# EAGLE design SwitchlesMD_OSC_small_reset_SMD_6 (EAGLE 9.0.0)
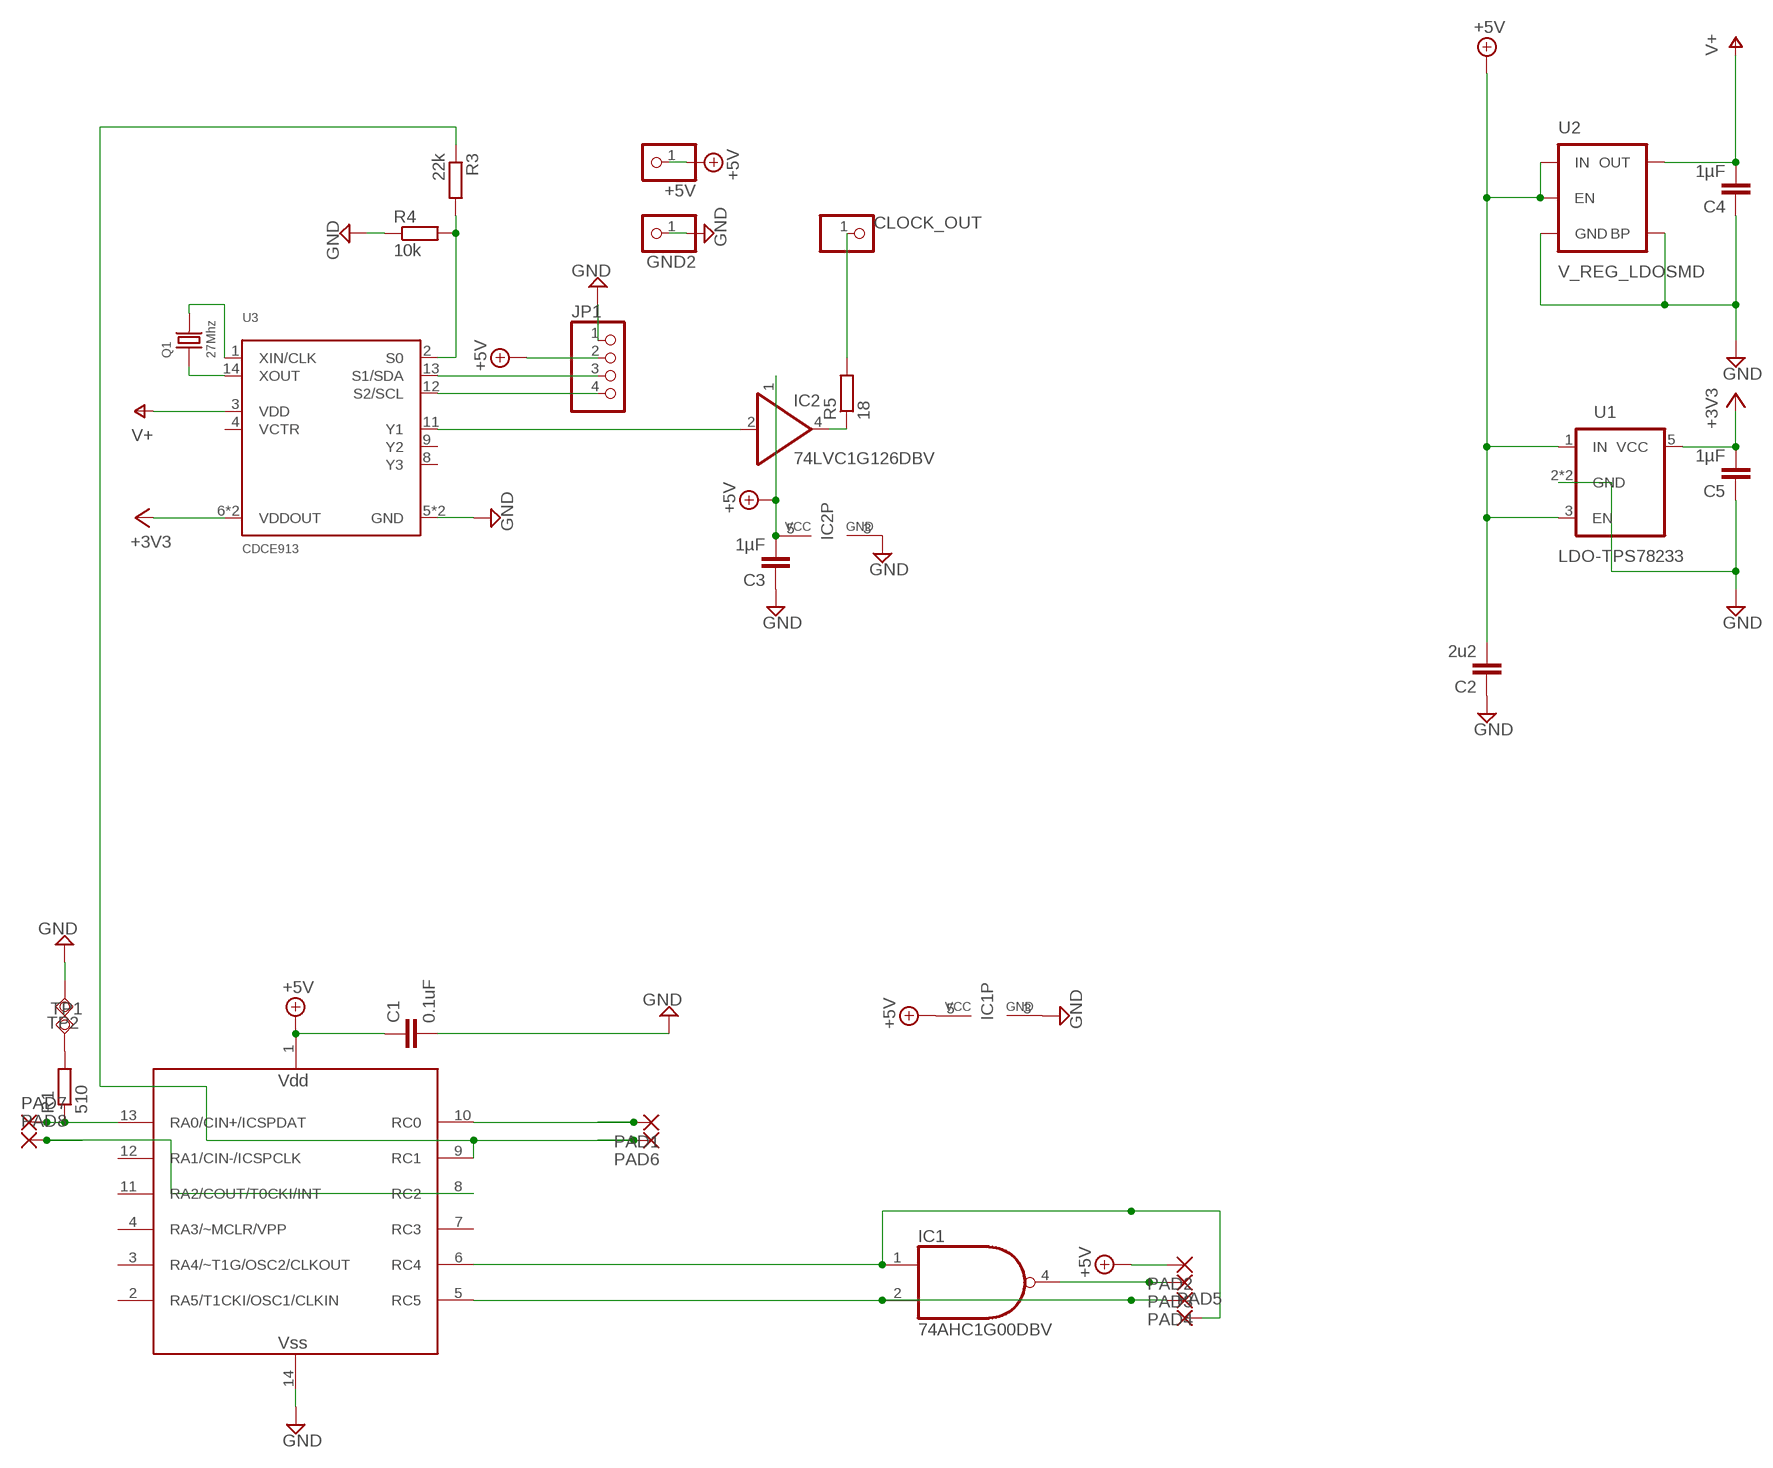
[diagram p0: schematic, sheet 1]

## Parts
+5V  PINHD-1X01_2.54  [1X01]
C1  0.1uF  C-EUC0603  [C0603]
C2  2u2  C-EUC0603  [C0603]
C3  1µF  C-EUC0603  [C0603]
C4  1µF  C-EUC0603  [C0603]
C5  1µF  C-EUC0603  [C0603]
CLOCK_OUT  PINHD-1X01_2.54  [1X01]
GND2  PINHD-1X01_2.54  [1X01]
IC1  74AHC1G00DBV  [SOT23-5]
IC2  74LVC1G126DBV  [SOT23-5]
JP1  PINHD-1X04_2.00  [1X04M]
PAD1  SMD2TOP  [SMD_SOIC]
PAD2  SMD2TOP  [SMD_SOIC]
PAD3  SMD2TOP  [SMD_SOIC]
PAD4  SMD2TOP  [SMD_SOIC]
PAD5  SMD2TOP  [SMD_SOIC]
PAD6  SMD2TOP  [SMD_SOIC]
PAD7  SMD2TOP  [SMD_SOIC]
PAD8  SMD2TOP  [SMD_SOIC]
PIC16F630  PIC16F630SL  [SOIC-14]
Q1  27Mhz  CRYSTAL'5032'  [X2-SMD-5.0X3.2X1.3MM]
R1  510  R-EU_R0603  [R0603]
R3  22k  R-EU_R0603  [R0603]
R4  10k  R-EU_R0603  [R0603]
R5  18  R-EU_R0603  [R0603]
TP1  TPSQTP07SQ  [TP07SQ]
TP2  TPSQTP07SQ  [TP07SQ]
U1  LDO-TPS78233  [SOT23-5]
U2  V_REG_LDOSMD  [SOT23-5]
U3  CDCE913  [TSSOP14]

## Nets
+1V8: C4.2 U2.5(OUT) U3.3(VDD) ; supply symbol labelled V+
+3V3: C5.2 U1.5(VCC) U3.6(VDDOUT) U3.7(VDDOUT)
+5V: +5V.1 C1.1 C2.2 C3.2 IC1.5(VCC) IC2.1(OE) IC2.5(VCC) JP1.2 PAD2.1(P) PIC16F630.1(VDD) U1.1(IN) U1.3(EN) U2.1(IN) U2.3(EN)
GND: C1.2 C2.1 C3.1 C4.1 C5.1 GND2.1 IC1.3(GND) IC2.3(GND) JP1.1 PIC16F630.14(VSS) R4.1 TP2.TP U1.2(GND) U1.4(GND) U2.2(GND) U2.4(BP) U3.5(GND) U3.10(GND)
LANG: PAD1.1(P) PIC16F630.10(RC0)
LED_EU: IC1.2(I1) PAD4.1(P) PIC16F630.5(RC5)
LED_JP: IC1.1(I0) PAD5.1(P) PIC16F630.6(RC4)
LED_US: IC1.4(O) PAD3.1(P)
N$3: R1.2 TP1.TP
N$8: PAD8.1(P) PIC16F630.8(RC2)
N$9: PAD7.1(P) PIC16F630.13(RA0/CIN+/ICSPDAT) R1.1
N$10: R3.2 R4.2 U3.2(S0)
N$17: IC2.4(O) R5.1
N$18: CLOCK_OUT.1 R5.2
N$22: Q1.1 U3.14(XOUT)
N$24: Q1.2 U3.1(XIN/CLK)
N$25: JP1.3 U3.13(S1/SDA)
N$26: JP1.4 U3.12(S2/SCL)
N$27: IC2.2(I) U3.11(Y1)
VIDEO: PAD6.1(P) PIC16F630.9(RC1) R3.1
Unconnected: PIC16F630.2(RA5/T1CKI/OSC1/CLKIN) PIC16F630.3(RA4/~T1G/OSC2/CLKOUT) PIC16F630.4(RA3/~MCLR/VPP) PIC16F630.7(RC3) PIC16F630.11(RA2/COUT/T0CKI/INT) PIC16F630.12(RA1/CIN-/ICSPCLK) U3.4(VCTR) U3.8(Y3) U3.9(Y2)

## Library data of the parts
+5V CLOCK_OUT GND2 = pinhead-2:PINHD-1X01: PIN HEADER
C1-C5 = resistor:C-EU: CAPACITOR, European symbol
IC1 = 74xx-little-us:74*1G00: 2-input NAND gate
IC2 = 74xx-little-de:74*1G126: Single Bus Buffer Gate With 3-State Outputs
JP1 = pinhead-2:PINHD-1X04: PIN HEADER
PAD1-PAD8 = TRP_Custom:SMD2: SMD PAD
PIC16F630 = microchip (2):PIC16F630: Microchip PIC16F630 14-pin 8-bit Flash microcontroller 1024 words program memory, 64 bytes RAM, 128 bytes EEPROM 12 I/O, 1 comparator, 1 8-bit timer, 1 16-bit timer
Q1 = Seeed-OPL-Crystal-Oscillator:CRYSTAL
R1 R3-R5 = resistor:R-EU_: RESISTOR, European symbol
TP1 TP2 = testpad:TPSQ: Test pad
U1 = SparkFun-PowerIC:LDO-TPS78233: Voltage Regulator LDO 500nA Ground Current, 150mA, Ultra-Low Quiescent Current Low-Dropout Linear Regulator.
U2 = SparkFun-PowerIC:V_REG_LDO: Voltage Regulator LDO Standard 150mA LDO voltage regulator in SOT-23 layout. Micrel part MIC5205. BP (by-pass) pin is used to lower output noise with 470pF cap.
U3 = TRP_Custom:CDCE913: CDCEx913 Programmable 1-PLL VCXO Clock Synthesizer With 1.8-V, 2.5-V, and 3.3-V Outputs http://www.ti.com/product/CDCE913

## Module S0
Ports: 

### Library data of the parts

## Board
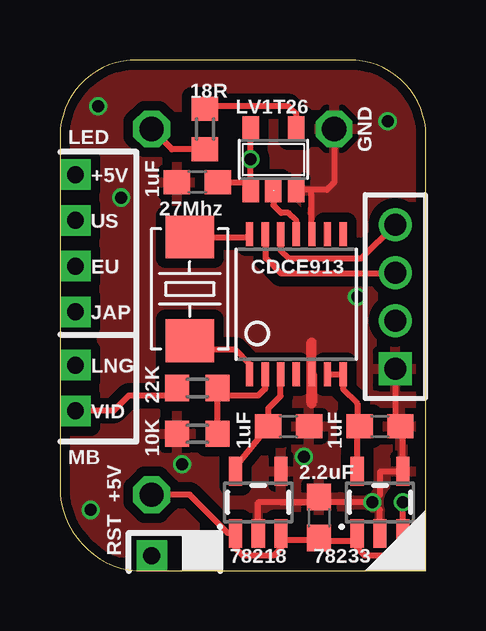
[diagram p1: board, top side]
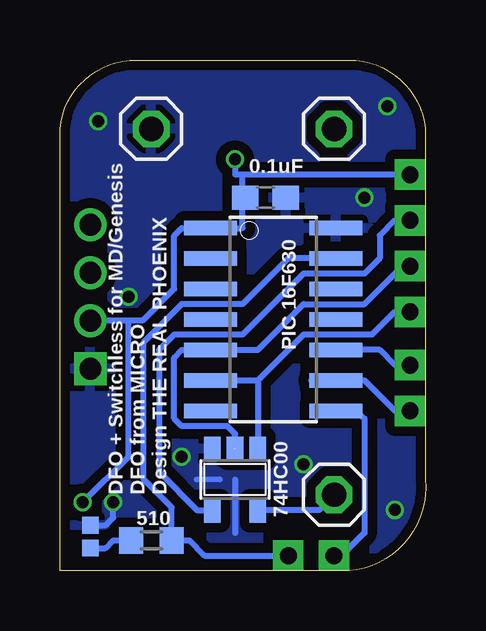
[diagram p2: board, bottom side, seen from below]

Size 15.25 x 21.29 mm. Coordinates in mm from the lower left corner, seen from the top.
Outline: 3.51,21.27 arc90 0.01,18.41 0.01,3.81 arc90 3.19,0 15.25,0 15.25,18.41 arc90 11.76,21.27 3.51,21.27
Copper layers (1*16): Top 0.035559375mm / dielectric 1.6mm / Bottom 0.035559375mm
Design rules "oshpark-2layer": minimum track width 6mil, minimum drill 10mil, track to track 6mil, track to pad 6mil, pad to pad 6mil, via to via 6mil, smd to smd 6mil, copper to edge 15mil, drill to drill 6mil, minimum pad ring 5mil, minimum via ring 5mil, stop-mask expansion 2.5mil, vias tented up to drill 0mil, thermal gap 10mil

### Footprints (pad centres in the part's own frame; a part is rotated, then mirrored left to right if it is on the bottom)
1X01 = drill 1.016 octagon: 1 0,0
C0603 = smd 1.1 x 1: 1 -0.85,0; 2 0.85,0
SOT23-5 = smd 0.69 x 0.99: 1 -0.95,-1.29; 2 0,-1.29; 3 0.95,-1.29; 4 0.95,1.3; 5 -0.95,1.3
1X04M = drill 0.914 square: 1 -3,0 | drill 0.914: 2 -1,0; 3 1,0; 4 3,0
SMD_SOIC = smd 0.635 x 1.27: 1 0,0
SOIC-14 = smd 2.21 x 0.61: 1 -2.616,4.445; 2 -2.616,3.175; 3 -2.616,1.905; 4 -2.616,0.635; 5 -2.616,-0.635; 6 -2.616,-1.905; 7 -2.616,-3.175; 8 2.616,-3.175; 9 2.616,-1.905; 10 2.616,-0.635; 11 2.616,0.635; 12 2.616,1.905; 13 2.616,3.175; 14 2.616,4.445
X2-SMD-5.0X3.2X1.3MM = smd 1.778 x 2.032: 1 -2.159,0; 2 2.159,0
R0603 = smd 1 x 1.1: 1 -0.85,0; 2 0.85,0
TP07SQ = smd 0.7 x 0.7: TP 0,0
SOT23-5' = smd 0.55 x 1.2: 1 -0.95,-1.3; 2 0,-1.3; 3 0.95,-1.3; 4 0.95,1.3; 5 -0.95,1.3
TSSOP14 = smd 0.305 x 0.991: 1 -1.95,-2.918; 2 -1.3,-2.918; 3 -0.65,-2.918; 4 0,-2.918; 5 0.65,-2.918; 6 1.3,-2.918; 7 1.95,-2.918; 8 1.95,2.918; 9 1.3,2.918; 10 0.65,2.918; 11 0,2.918; 12 -0.65,2.918; 13 -1.3,2.918; 14 -1.95,2.918

### Placement (x,y rotation side)
+5V  3.82,3.17 0 bottom
C1  6.68,15.56 0 bottom
C2  10.81,2.22 270 top
C3  5.73,16.19 0 top
C4  9.54,6.03 180 top
C5  13.35,6.03 180 top
CLOCK_OUT  3.82,18.41 0 bottom
GND2  11.44,18.41 0 bottom
IC1  7.95,3.81 180 bottom
IC2  8.9,17.14 0 top
JP1  13.98,11.43 90 top
PAD1  0.65,8.57 90 top
PAD2  0.65,16.51 90 top
PAD3  0.65,14.61 90 top
PAD4  0.65,12.7 90 top
PAD5  0.65,10.79 90 top
PAD6  0.65,6.67 90 top
PAD7  5.73,0.64 0 top
PAD8  3.82,0.64 180 top
PIC16F630  6.36,9.84 0 bottom
Q1  5.41,11.75 270 top
R1  11.44,1.27 180 bottom
R3  5.73,7.62 0 top
R4  5.73,5.71 0 top
R5  6.05,18.41 270 top
TP1  13.98,0.95 0 bottom
TP2  13.98,1.91 0 bottom
U1  LDO-TPS78233  [SOT23-5']  13.35,2.86 0 top
U2  V_REG_LDOSMD  [SOT23-5']  8.27,2.86 0 top
U3  9.86,11.11 0 top

### Tracks (layer width: path | path; a pad name or v marks a point on that pad's centre or on a via)
+1V8
  Top 0.254: U3.3 9.21,7.29 8.69,6.77 C4.2 7.32,4.35 U2.5
+3V3
  Top 0.254: U3.6 U3.7 11.81,7.58 12.4,6.99 12.4,5.99 | U1.5 12.4,4.76 12.4,5.78 | 12.4,5.99 12.49,6.01 | 12.49,6.01 C5.2 | 12.4,5.78 12.49,6.01 | 12.4,5.99 12.4,5.78
+5V  (via drill 0.5, 0.7 pad 1.27)
  Top 0.254: 12.4,1.24 12.4,0.95 12.71,0.64 13.98,0.64 14.3,0.95 U1.3 v14.3,2.86 | 12.4,1.24 U1.1 | 12.4,1.24 10.51,1.24 C2.2 10.81,1.27 9.25,1.27 U2.3 9.22,0.95 8.9,0.64 7.63,0.64 7.32,0.95 U2.1 | U2.1 | IC2.1 7.95,16.19 | U2.1 7.32,1.9 7.32,1.59 | C3.2 7.85,16.19 7.95,16.19 | U2.1 7.32,1.59 | 7.32,1.59 7,1.59 5.41,3.17 +5V.1 | 7.95,16.19 v7.95,17.14 IC2.5
  Bottom 0.254: 12.4,10.43 12.4,4.76 v14.3,2.86 | 12.4,10.43 11.81,10.43 10.49,11.75 10.49,13.97 10.17,14.29 PIC16F630.1 7.63,14.29 7.63,15.46 C1.1 7.63,15.66 7.63,16.51 | 12.4,10.43 JP1.2 | IC1.5 7,2.54 4.43,2.54 +5V.1 | v7.95,17.14 7.95,16.51 7.63,16.51 | PAD2.1 7.63,16.51
  other vias: 0.65,16.51
GND  (via drill 0.5)
  Top 0.254: JP1.1 13.98,5.82 C5.1 14.3,5.62 U1.4 14.27,4.13 13.35,4.13 13.35,3.17 v13.03,2.86 | U2.2 8.27,2.86 10.81,2.86 | 9.22,2.86 10.81,2.86 | U1.2 13.35,2.54 v13.03,2.86 | v13.03,2.86 10.81,2.86 | 10.81,2.86 C2.1 | GND2.1 11.44,16.19 11.13,15.88 10.49,15.88 | 10.49,15.88 9.87,15.88 IC2.3 10.49,15.88 | U3.10 10.49,14.67 10.49,15.88
  Top 0.406: U3.5 10.51,7 10.49,6.99 10.49,9.53
  Bottom 0.254: 8.59,3.81 9.54,3.81 | 10.19,4.76 v10.17,4.76 | 7.95,3.81 7.95,1.59 | TP2.TP 13.35,1.91 13.03,2.22 v13.03,2.86
  other vias: 1.28,2.54 5.09,4.45 12.4,11.43 13.67,18.73 1.6,19.37 2.55,15.56
  pour Bottom (isolate 0.406): -0.3,-0.32 15.57,-0.32 15.57,21.59 -0.3,21.59
  pour Top (isolate 0.406): -0.3,21.59 -0.3,-0.32 15.57,-0.32 15.57,21.59
LANG  (via drill 0.7 pad 1.27)
  Bottom 0.254: PAD1.1 1.28,8.57 1.92,9.21 PIC16F630.10
  other vias: 0.65,8.57
LED_EU  (via drill 0.7 pad 1.27)
  Bottom 0.254: IC1.2 7.95,5.71 8.27,6.03 10.17,6.03 10.49,6.35 10.49,8.89 10.17,9.21 PIC16F630.5 7,9.21 5.09,11.11 2.55,11.11 0.97,12.7 PAD4.1
  other vias: 0.65,12.7
LED_JP  (via drill 0.7 pad 1.27)
  Bottom 0.254: 7,7.94 5.09,9.84 2.24,9.84 1.28,10.79 PAD5.1 | 7,7.94 7,7.96 IC1.1 | PIC16F630.6 7,7.94
  other vias: 0.65,10.79
LED_US  (via drill 0.7 pad 1.27)
  Bottom 0.254: PAD3.1 1.28,14.61 1.92,13.97 1.92,13.02 2.55,12.38 5.09,12.38 7.63,9.84 10.49,9.84 11.13,9.21 11.13,4.13 9.51,2.51 IC1.4
  other vias: 0.65,14.61
N$3
  Bottom 0.254: TP1.TP 13.35,0.95 13.03,1.27 R1.2
N$8  (via drill 0.7 pad 1.27)
  Bottom 0.254: PIC16F630.8 2.87,6.67 2.55,6.35 2.55,1.59 3.51,0.64 PAD8.1
  other vias: 3.82,0.64
N$9  (via drill 0.7 pad 1.27)
  Bottom 0.254: PIC16F630.13 5.73,13.02 7.63,11.11 10.17,11.11 11.76,9.53 11.76,3.81 10.59,2.64 R1.1 9.86,1.27 9.22,0.64 PAD7.1
  other vias: 5.73,0.64
N$10
  Top 0.254: U3.2 8.56,7.59 8.27,7.3 6.58,7.3 | R4.2 6.58,7.3 | 6.58,7.3 R3.2
N$17
  Top 0.254: IC2.4 9.85,19.05 9.54,19.37 6.15,19.37 R5.1
N$18
  Top 0.254: R5.2 4.67,17.56 CLOCK_OUT.1
N$22
  Top 0.254: Q1.1 7.78,13.91 U3.14
N$24
  Top 0.254: 5.67,9.21 Q1.2 5.16,9.21 5.67,9.21 | U3.1 7.91,8.62 7.32,9.21 5.67,9.21
N$25
  Top 0.254: U3.13 8.59,13.37 8.59,13.02 9.22,12.38 13.94,12.38 JP1.3
N$26
  Top 0.254: U3.12 9.21,13.35 9.54,13.02 12.57,13.02 JP1.4
N$27
  Top 0.254: IC2.2 8.9,15.24 9.22,14.92 9.54,14.92 9.86,14.61 U3.11
VIDEO  (via drill 0.7 pad 1.27)
  Top 0.254: 4.78,7.3 R3.1 4.56,7.3 2.87,7.3 2.24,6.67 PAD6.1
  Bottom 0.254: PAD6.1 1.28,6.67 2.55,7.94 PIC16F630.9 4.78,7.94
  other vias: 0.65,6.67

### Text on the board
tNames: 18R | LV1T26 | GND | LED | +5V | 1uF | US | 27Mhz | EU | CDCE913 | JAP | LNG | 22K | VID | 1uF | 1uF | MB | 10K | 2.2uF | +5V | RST | 78218 | 78233
bNames: PIC 16F630 | 74HC00 | DFO + Switchless for MD/Genesis / DFO from MICRO / Design THE REAL PHOENIX | 510